# Altium schematic sheet Level-Translator.SchDoc: Bidir Level Translator
size Letter; ApprovedBy: kc; Organization: Cegep Limoilou; Address1: 1300, 8e Avenue; Address2: Québec, QC; Address3: Canada; Address4: G1J 5L5; SheetNumber: 8; SheetTotal: 10
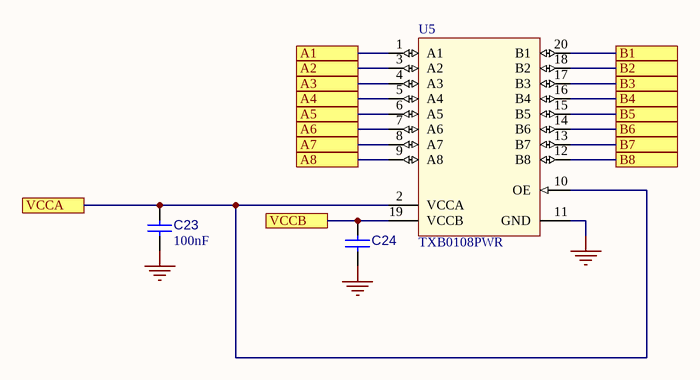
[diagram p0: Level-Translator.SchDoc]

## Parts
C23  value 100nF  [C_1005[0402]]  (hidden comment: Cap 100nF 0402)
C24  Cap 100nF 0402  [C_1005[0402]]  (value not drawn)
U5  TXB0108PWR  [U_TSSOP65P660X450-20]

## Ports
A1 (see Affichage-LCD[1B]), A2 (see Affichage-LCD[1B]), A3 (see Affichage-LCD[1B]), A4 (see Affichage-LCD[1B]), A5 (see Affichage-LCD[1B]), A6 (see Affichage-LCD[1B]), A7 (see Affichage-LCD[1B]), A8 (see Affichage-LCD[1B]), B1 (see Affichage-LCD[1B]), B2 (see Affichage-LCD[1B]), B3 (see Affichage-LCD[1B]), B4 (see Affichage-LCD[1B]), B5 (see Affichage-LCD[1B]), B6 (see Affichage-LCD[1B]), B7 (see Affichage-LCD[1B]), B8 (see Affichage-LCD[1B]), VCCA (see Affichage-LCD[1B]), VCCB (see Affichage-LCD[1B])

## Nets
GND: C23.1 C24.1 U5.11(GND)
A1: U5.1(A1) ; port A1
A2: U5.3(A2) ; port A2
A3: U5.4(A3) ; port A3
A4: U5.5(A4) ; port A4
A5: U5.6(A5) ; port A5
A6: U5.7(A6) ; port A6
A7: U5.8(A7) ; port A7
A8: U5.9(A8) ; port A8
B1: U5.20(B1) ; port B1
B2: U5.18(B2) ; port B2
B3: U5.17(B3) ; port B3
B4: U5.16(B4) ; port B4
B5: U5.15(B5) ; port B5
B6: U5.14(B6) ; port B6
B7: U5.13(B7) ; port B7
B8: U5.12(B8) ; port B8
VCCA: C23.2 U5.2(VCCA) U5.10(OE) ; port VCCA
VCCB: C24.2 U5.19(VCCB) ; port VCCB

## Notes on the sheet
- Titre :
- Conception :
- Date :
- Approbation :
- Heure :
- Révision :
- Feuille
- de
- Fichier :

## Library data of the parts
C23 C24 = CAP001: Capacitor type 1; Manufacturer 1: Taiyo Yuden; Manufacturer Part Number 1: UMK105B7104KV-FR; LibRef: CAP001; CEGEP: KCOND01SM; Tolerance: 10%; Rated Voltage: 50V; Dielectric: X7R; Mounting Technology: SMT; Supplier 1: LCSC; Supplier Part Number 1: C2167491
U5 = U_TXB0108PWR: IC 8-Bit Bidirectional Voltage-Level Translator with Auto-Direction Sensing 20-Pin TSSOP (PW); Manufacturer 1: Texas Instruments; Mounting Technology: SMT; Manufacturer Part Number 1: TXB0108PWR; Supplier 1: LCSC; Supplier Part Number 1: C53406